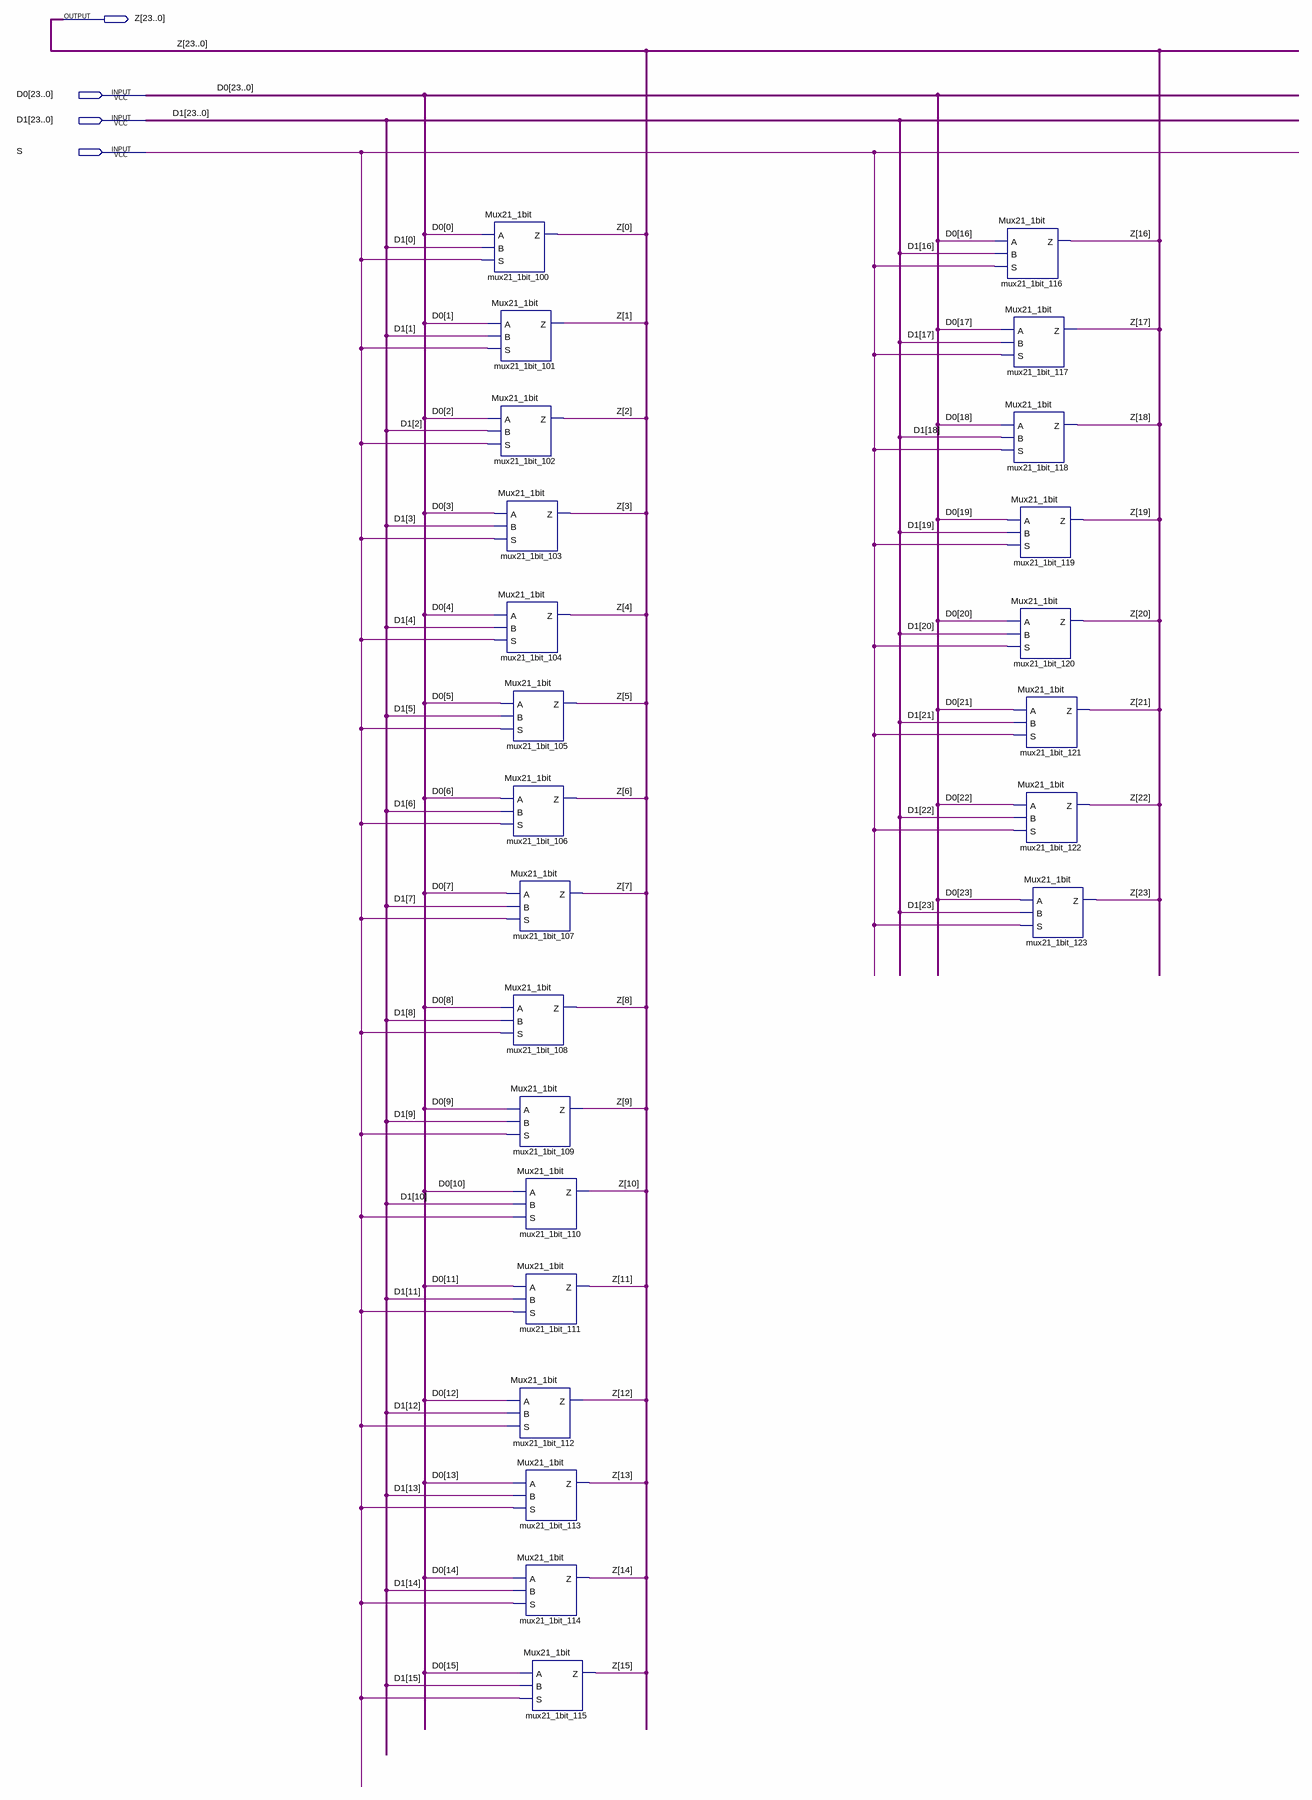
[diagram p0: schematic sheet]
// Quartus schematic Mux21_24bit.bdf as structural Verilog: 24 symbols, 4 pins
module Mux21_24bit (
  input  [23:0] D0,
  input  [23:0] D1,
  input  S,
  output [23:0] Z
);

  Mux21_1bit mux21_1bit_100 (.A(D0[0]), .B(D1[0]), .S(S), .Z(Z[0]));
  Mux21_1bit mux21_1bit_101 (.A(D0[1]), .B(D1[1]), .S(S), .Z(Z[1]));
  Mux21_1bit mux21_1bit_102 (.A(D0[2]), .B(D1[2]), .S(S), .Z(Z[2]));
  Mux21_1bit mux21_1bit_103 (.A(D0[3]), .B(D1[3]), .S(S), .Z(Z[3]));
  Mux21_1bit mux21_1bit_104 (.A(D0[4]), .B(D1[4]), .S(S), .Z(Z[4]));
  Mux21_1bit mux21_1bit_105 (.A(D0[5]), .B(D1[5]), .S(S), .Z(Z[5]));
  Mux21_1bit mux21_1bit_106 (.A(D0[6]), .B(D1[6]), .S(S), .Z(Z[6]));
  Mux21_1bit mux21_1bit_107 (.A(D0[7]), .B(D1[7]), .S(S), .Z(Z[7]));
  Mux21_1bit mux21_1bit_108 (.A(D0[8]), .B(D1[8]), .S(S), .Z(Z[8]));
  Mux21_1bit mux21_1bit_109 (.A(D0[9]), .B(D1[9]), .S(S), .Z(Z[9]));
  Mux21_1bit mux21_1bit_110 (.A(D0[10]), .B(D1[10]), .S(S), .Z(Z[10]));
  Mux21_1bit mux21_1bit_111 (.A(D0[11]), .B(D1[11]), .S(S), .Z(Z[11]));
  Mux21_1bit mux21_1bit_112 (.A(D0[12]), .B(D1[12]), .S(S), .Z(Z[12]));
  Mux21_1bit mux21_1bit_113 (.A(D0[13]), .B(D1[13]), .S(S), .Z(Z[13]));
  Mux21_1bit mux21_1bit_114 (.A(D0[14]), .B(D1[14]), .S(S), .Z(Z[14]));
  Mux21_1bit mux21_1bit_115 (.A(D0[15]), .B(D1[15]), .S(S), .Z(Z[15]));
  Mux21_1bit mux21_1bit_116 (.A(D0[16]), .B(D1[16]), .S(S), .Z(Z[16]));
  Mux21_1bit mux21_1bit_117 (.A(D0[17]), .B(D1[17]), .S(S), .Z(Z[17]));
  Mux21_1bit mux21_1bit_118 (.A(D0[18]), .B(D1[18]), .S(S), .Z(Z[18]));
  Mux21_1bit mux21_1bit_119 (.A(D0[19]), .B(D1[19]), .S(S), .Z(Z[19]));
  Mux21_1bit mux21_1bit_120 (.A(D0[20]), .B(D1[20]), .S(S), .Z(Z[20]));
  Mux21_1bit mux21_1bit_121 (.A(D0[21]), .B(D1[21]), .S(S), .Z(Z[21]));
  Mux21_1bit mux21_1bit_122 (.A(D0[22]), .B(D1[22]), .S(S), .Z(Z[22]));
  Mux21_1bit mux21_1bit_123 (.A(D0[23]), .B(D1[23]), .S(S), .Z(Z[23]));
endmodule
